# Altium schematic sheet WIFI.SchDoc
size A2; SheetNumber: 6; SheetTotal: 8
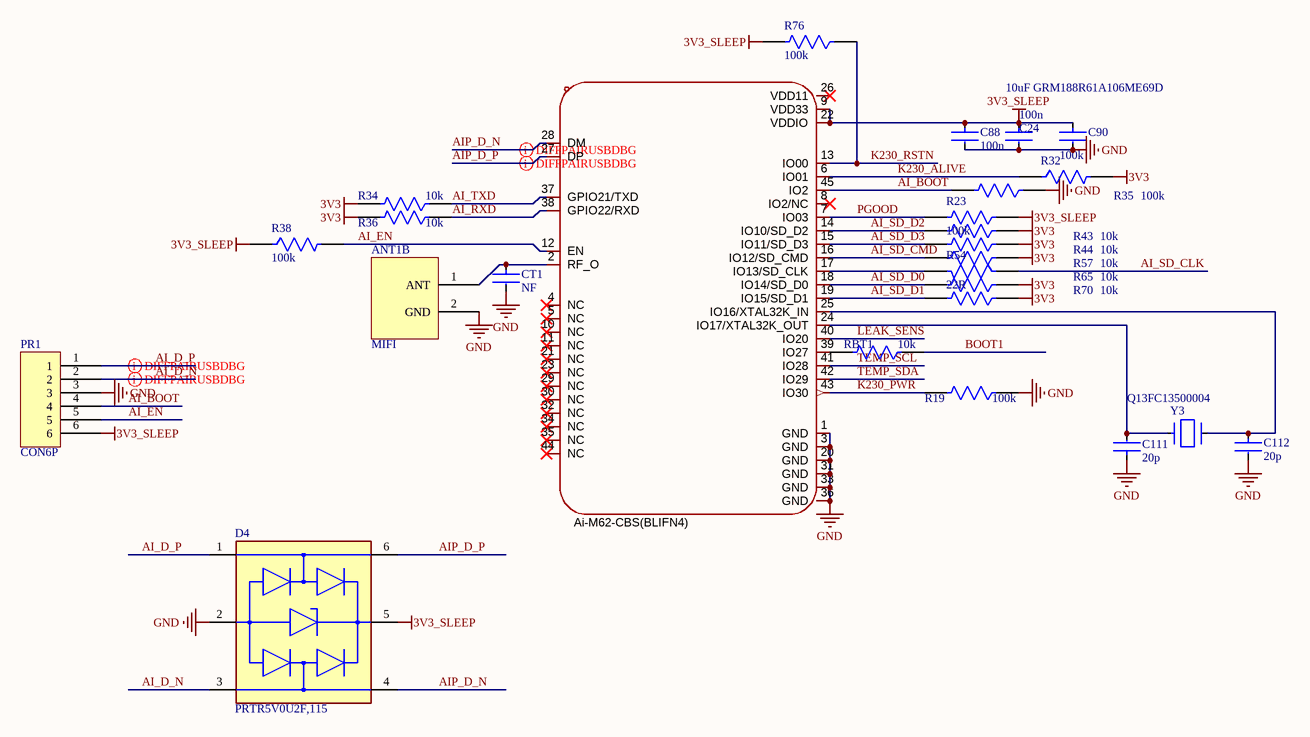
[diagram p0: WIFI.SchDoc]

## Parts
ANT1  MIFI  [IFA_MAGUS]  (part B of 2)  (net tie, no BOM)
C24  100n  [CAP_0402]
C88  100n  [CAP_0402]
C90  10uF GRM188R61A106ME69D  [FP-GRM188-0_15-MFG]
C111  20p  [CAP_0402]
C112  20p  [CAP_0402]
CT1  NF  [CAP_0402]
D4  PRTR5V0U2F,115  [FP-SOT886-MFG]
PR1  CON6P  [CON6P]
R19  100k  [RES_0402]
R23  100k  [RES_0402]
R32  100k  [RES_0402]
R34  10k  [RES_0402]
R35  100k  [RES_0402]
R36  10k  [RES_0402]
R38  100k  [RES_0402]
R43  10k  [RES_0402]
R44  10k  [RES_0402]
R54  22R  [RES_0402]
R57  10k  [RES_0402]
R65  10k  [RES_0402]
R70  10k  [RES_0402]
R76  100k  [RES_0402]
RBT1  10k  [RES_0402]
U11  ai-m62-cbs(blifn4)  [AI-M62-CBS]
Y3  Q13FC13500004  [FP-ABS07-MFG]

## Nets
3V3: R32.2 R34.2 R36.2 R43.1 R44.1 R57.1 R65.1 R70.1
3V3_SLEEP: C24.1 C88.1 C90.1 D4.5(VCC) PR1.6 R23.1 R38.1 R76.2 U11.9(VDD33) U11.22(VDDIO)
GND: ANT1.2(GND) C24.2 C88.2 C90.2 C111.1 C112.2 CT1.2 D4.2(GND) PR1.3 R19.1 R35.1 U11.1(GND) U11.3(GND) U11.20(GND) U11.31(GND) U11.33(GND) U11.36(GND)
AI_BOOT: PR1.4 R35.2 U11.45(IO2)
AI_D_N: D4.3(I/O2) PR1.2
AI_D_P: D4.1(I/O1) PR1.1
AI_EN: PR1.5 R38.2 U11.12(EN)
AI_RXD: R36.1 U11.38(GPIO22/RXD)
AI_SD_CLK: R54.1
AI_SD_CMD: R57.2 U11.16(IO12/SD_CMD)
AI_SD_D0: R65.2 U11.18(IO14/SD_D0)
AI_SD_D1: R70.2 U11.19(IO15/SD_D1)
AI_SD_D2: R43.2 U11.14(IO10/SD_D2)
AI_SD_D3: R44.2 U11.15(IO11/SD_D3)
AI_TXD: R34.1 U11.37(GPIO21/TXD)
AIP_D_N: D4.4(I/O2) U11.28(DM)
AIP_D_P: D4.6(I/O1) U11.27(DP)
BOOT1: RBT1.1
K230_ALIVE: R32.1 U11.6(IO01)
K230_PWR: R19.2 U11.43(IO30)
K230_RSTN: R76.1 U11.13(IO00)
LEAK_SENS: U11.40(IO20)
PGOOD: R23.2 U11.7(IO03)
TEMP_SCL: U11.41(IO28)
TEMP_SDA: U11.42(IO29)
NetANT1_1: ANT1.1(ANT) CT1.1 U11.2(RF_O)
NetC111_2: C111.2 U11.24(IO17/XTAL32K_OUT) Y3.1
NetC112_1: C112.1 U11.25(IO16/XTAL32K_IN) Y3.2
NetR54_2: R54.2 U11.17(IO13/SD_CLK)
NetRBT1_2: RBT1.2 U11.39(IO27)

Not connected (* = marked no-connect by the designer): U11 4(NC)* 5(NC)* 8(IO2/NC)* 10(NC)* 11(NC)* 21(NC)* 23(NC)* 26(VDD11)* 29(NC)* 30(NC)* 32(NC)* 34(NC)* 35(NC)* 44(NC)*

## Layout directives
differential pair; differential pair class USBD: AI_D_N, AI_D_P, AIP_D_N, AIP_D_P

## Library data of the parts
C24 C88 = CMP-03422-001116-1: C307331; Tolerance: 10%; Voltage Rating: 50V; Capacitance: 100nF; Value: 100nF; Max Operating Temperature: 125°C; Case Code (Metric): 1005; RoHS Compliant: Yes; Series: -; Case Code (Imperial): 0402; Min Operating Temperature: -55°C; Mount: Surface Mount; Case/Package: 0402; Packaging: Cut Tape
C90 = CMP-06035-003612-1: C19702; Tolerance: 20%; Dielectric: X5R; Voltage Rating: 10V; Material: Ceramic; Package Quantity: 4000; Width: 0.8mm; Case/Package: 0603; Thickness: 0.035inch; Capacitance: 10uF; Voltage Rating (DC): 10V; Termination: SMD/SMT; Length: 1.6mm; Lead Free: Lead Free; Mount: Surface Mount; Height: 0.8mm; Depth: 0.8mm; Packaging: Tape and Reel; Weight: 0.000222oz; Min Operating Temperature: -55°C; Case Code (Metric): 1608; Max Operating Temperature: 85°C; Case Code (Imperial): 0603; Value: 10uF
C111 C112 = CMP-03422-001116-1: C1554; Tolerance: 10%; Voltage Rating: 50V; Capacitance: 20pF; Value: 20pF; Max Operating Temperature: 125°C; Case Code (Metric): 1005; RoHS Compliant: Yes; Series: -; Case Code (Imperial): 0402; Min Operating Temperature: -55°C; Mount: Surface Mount; Case/Package: 0402; Packaging: Cut Tape
CT1 = CMP-03422-001116-1: Tolerance: 10%; Voltage Rating: 50V; Max Operating Temperature: 125°C; Case Code (Metric): 1005; RoHS Compliant: Yes; Series: -; Case Code (Imperial): 0402; Min Operating Temperature: -55°C; Mount: Surface Mount; Case/Package: 0402; Packaging: Cut Tape
D4 = CMP-14436-000003-1: C478118; Manufacturer: Nexperia; Capacitance: 1pF; Reverse Standoff Voltage: 5.5V; Number Of Channels: 2; Automotive Grade: Grade 3; Direction: Unidirectional; Value: 1pF; Breakdown Voltage: 6V; Octopart: https://octopart.com/prtr5v0u2f%2C115-nexperia-78741690; Height: 0.5mm; Category: Diode; RoHS: TRUE; Automotive: Yes; Digikey Description: TVS DIODE 5.5V 6XSON SOT886; Device Class L1: Circuit Protection; Ambient Temperature Range High: +85°C; ComponentLink2Description: Datasheet; Manufacturer Part Number: PRTR5V0U2F,115; Device Class L3: unset; Footprint Url: https://assets.nexperia.com/documents/outline-drawing/SOT886.pdf; Lead Free: Yes; Ambient Temperature Range Low: -40°C; Device Class L2: TVS Diodes; Package: SOT886; ComponentLink2URL: https://assets.nexperia.com/documents/data-sheet/PRTR5V0U2F_PRTR5V0U2K.pdf
R19 R23 R32 R35 R38 R76 = CMP-03412-016018-1: C25741; Tolerance: 1%; Temperature Coefficient: 100ppm/°C; Resistance: 100kOhm; Max Power Dissipation: 63mW; Value: 100kOhm; Ratings: AEC-Q200; Resistor Type: Thick Film; Number of Terminations: 2; RoHS Compliant: Yes; Min Operating Temperature: -55°C; Case/Package: 0402; Series: AC; Length: 0.039inch; Width: 0.02inch; Features: Moisture Resistant; Height: 0.015inch; Packaging: Tape and Reel; Max Operating Temperature: 155°C
R34 R36 R43 R44 R57 R65 R70 = CMP-03412-016018-1: C25744; Tolerance: 1%; Temperature Coefficient: 100ppm/°C; Resistance: 10kOhm; Max Power Dissipation: 63mW; Value: 10kOhm; Ratings: AEC-Q200; Resistor Type: Thick Film; Number of Terminations: 2; RoHS Compliant: Yes; Min Operating Temperature: -55°C; Case/Package: 0402; Series: AC; Length: 0.039inch; Width: 0.02inch; Features: Moisture Resistant; Height: 0.015inch; Packaging: Tape and Reel; Max Operating Temperature: 155°C
R54 = CMP-03412-016018-1: C25092; Tolerance: 1%; Temperature Coefficient: 100ppm/°C; Resistance: 22Ohm; Max Power Dissipation: 63mW; Value: 22Ohm; Ratings: AEC-Q200; Resistor Type: Thick Film; Number of Terminations: 2; RoHS Compliant: Yes; Min Operating Temperature: -55°C; Case/Package: 0402; Series: AC; Length: 0.039inch; Width: 0.02inch; Features: Moisture Resistant; Height: 0.015inch; Packaging: Tape and Reel; Max Operating Temperature: 155°C
RBT1 = CMP-03412-016018-1: C25744; Tolerance: 1%; Temperature Coefficient: 100ppm/°C; Resistance: 768kR; Max Power Dissipation: 63mW; Ratings: AEC-Q200; Resistor Type: Thick Film; Number of Terminations: 2; RoHS Compliant: Yes; Min Operating Temperature: -55°C; Case/Package: 0402; Series: AC; Length: 0.039inch; Width: 0.02inch; Features: Moisture Resistant; Height: 0.015inch; Packaging: Tape and Reel; Max Operating Temperature: 155°C
U11 = ai-m62-cbs(blifn4): C41368035; Manufacturer: Ai-Thinker(安信可); Utilized IC / Part: BL616; AddInBom: yes; ModelId: 220c4423d0fa4477abd1b31893269491; ModelName: WIRELM-SMD_AI-M62-CBS; ModelTransform: 472.44,472.44,0,0,0,0,0.001,0.005,0; Interface Type: I2C；GPIO；UART；USB2.0；SPI；PWM；SDIO；I2S; Output Power: 22dBm; Voltage - Supply: 2.97V~3.6V; Receive  Current: 59mA; Send  Current: 394mA; Sensitivity: -98dBm; LCSC Part Name: Wi-Fi6+BLE5.3模组; SupplierPart: C41368035; ManufacturerPart: Ai-M62-CBS(BLIFN4); Supplier Footprint: SMD,12x12mm; JLCPCB Part Class: Extended Part; Datasheet: https://item.szlcsc.com/datasheet/Ai-M62-CBS(BLIFN4)/43122706.html; Supplier: LCSC; ConvertToPcb: yes; SymbolName: AI-M62-CBS(BLIFN4); FootprintName: WIRELM-SMD_AI-M62-CBS; Operating Temperature: -40℃~+85℃
Y3 = CMP-0447-00001-4: C32346; Frequency: 32.768kHz; ESR (Equivalent Series Resistance): 70kR; Frequency Tolerance: 20ppm; Load Capacitance: 12.5pF; Operating Frequency: 32.768 kHz; Radiation Hardening: No; Length: 3.2mm; Max Operating Temperature: 85°C; Number of Pins: 2; Series: ABS07; Min Operating Temperature: -40°C; Packaging: Tape and Reel; Height: 0.9mm; Width: 1.5mm; Depth: 1.5mm; RoHS Compliant: Yes; Tolerance: 20ppm; Termination: SMD/SMT; Lead Free: Lead Free; Series Resistance: 70kR; REACH SVHC: No SVHC; Case/Package: CSMD; Package Quantity: 3000